# EAGLE design fireboy_esp (EAGLE 7.5.0)
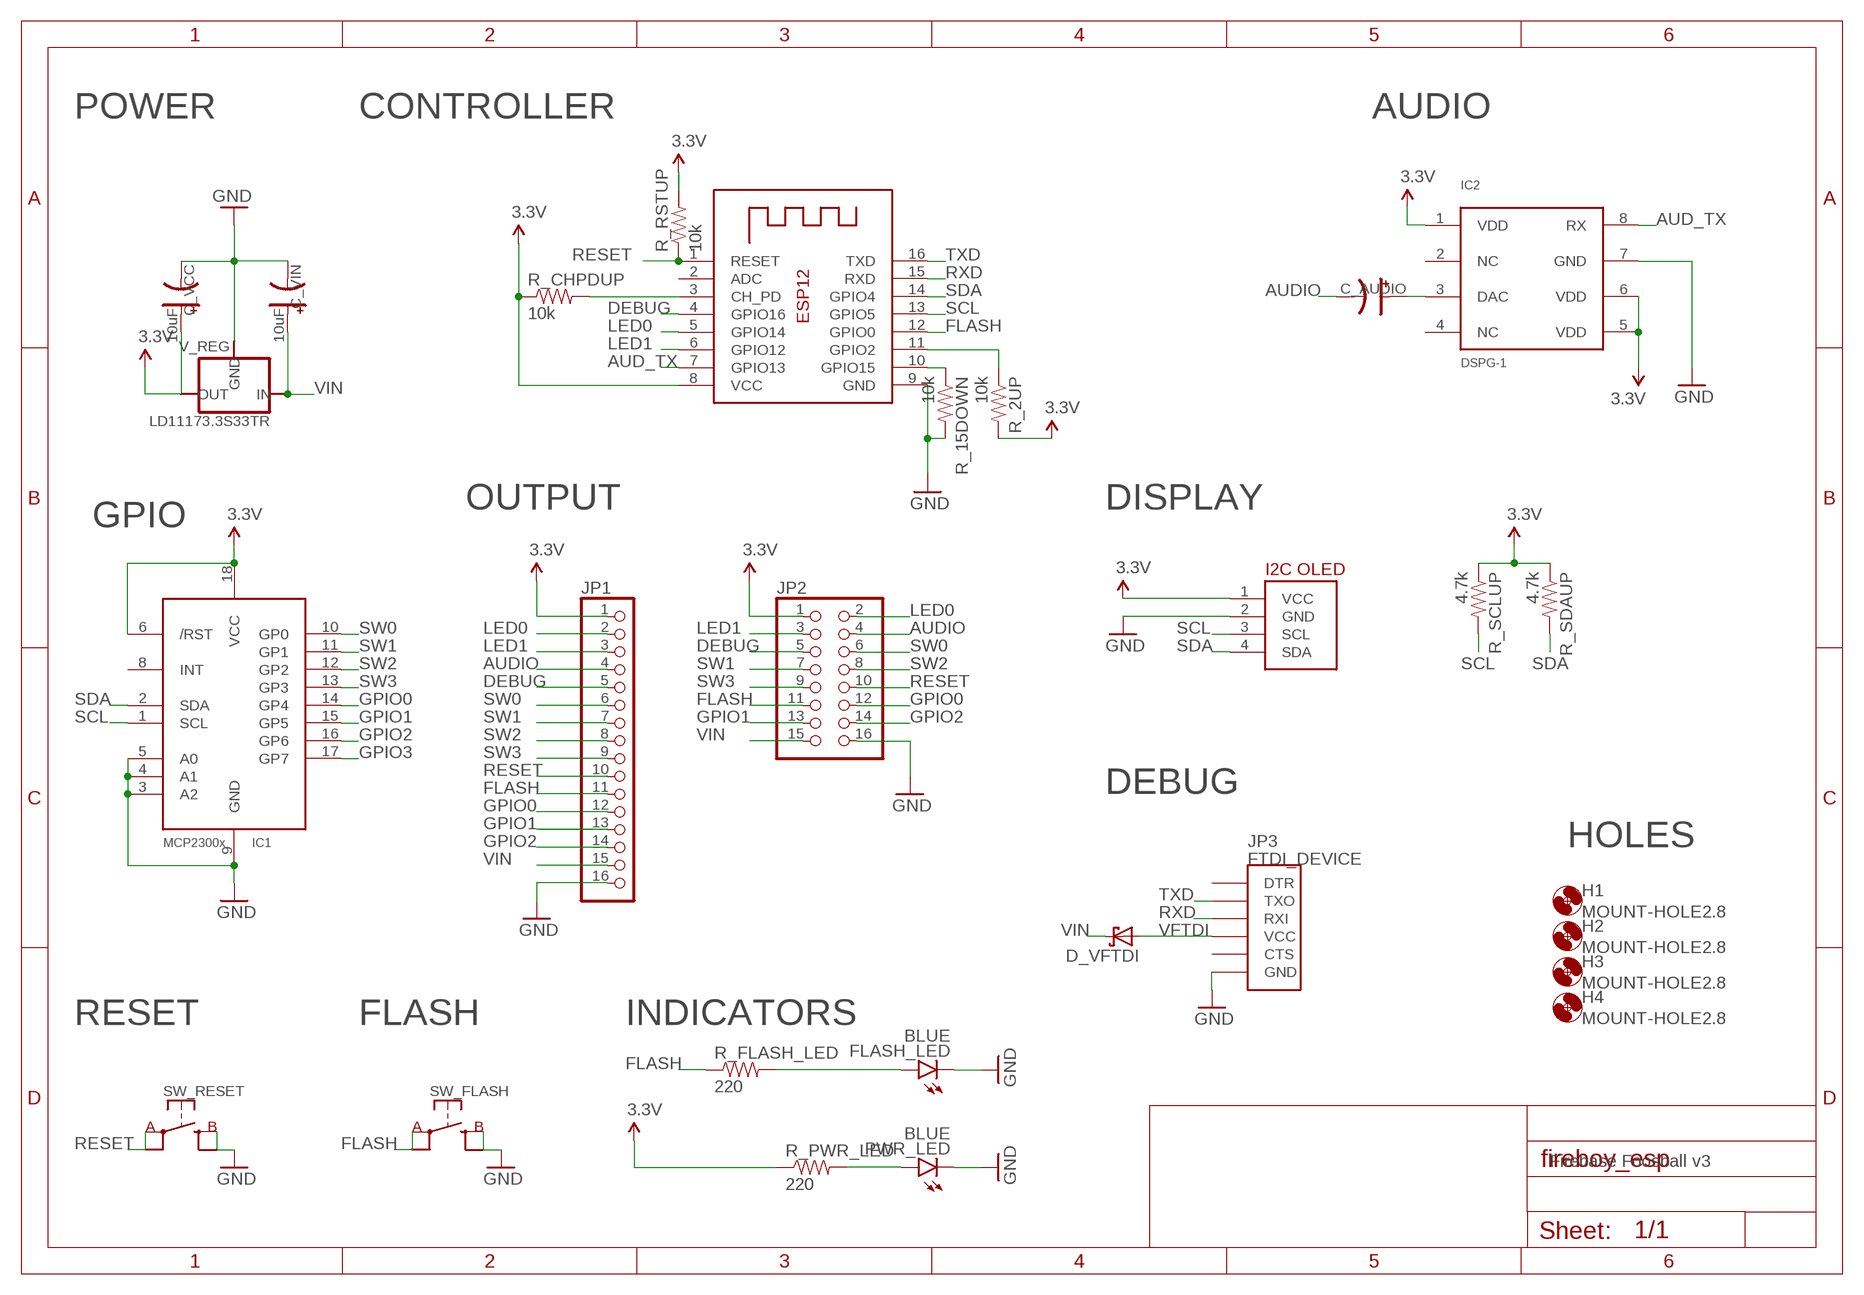
[diagram p0: schematic, sheet 1]

## Parts
C_AUDIO  CAP-POL025X50  [CAP-POL-025X50]
C_VCC  10uF  CAP-POL025X50  [CAP-POL-025X50]
C_VIN  10uF  CAP-POL025X50  [CAP-POL-025X50]
D_VFTDI  SCHOTTKY-DIODEDO41  [DO41-10]
FLASH_LED  BLUE  LED3MM  [LED3MM]
H1  MOUNT-HOLE2.8  [2,8]
H2  MOUNT-HOLE2.8  [2,8]
H3  MOUNT-HOLE2.8  [2,8]
H4  MOUNT-HOLE2.8  [2,8]
IC0  ESP-12  [ESP-12]
IC1  MCP23008/P  [DIL18]
IC2  DSPG-1  [DIL08]
JP1  PINHD-1X16  [1X16]
JP2  PINHD-2X8  [2X08]
JP3  FTDI_DEVICE  [FTDI_DEVICE_SIDE]
PWR_LED  BLUE  LED3MM  [LED3MM]
R_2UP  10k  RESISTORAXIAL-0.3  [AXIAL-0.3]
R_15DOWN  10k  RESISTORAXIAL-0.3  [AXIAL-0.3]
R_CHPDUP  10k  RESISTORAXIAL-0.3  [AXIAL-0.3]
R_FLASH_LED  220  RESISTORAXIAL-0.3  [AXIAL-0.3]
R_PWR_LED  220  RESISTORAXIAL-0.3  [AXIAL-0.3]
R_RSTUP  10k  RESISTORAXIAL-0.3  [AXIAL-0.3]
R_SCLUP  4.7k  RESISTORAXIAL-0.3  [AXIAL-0.3]
R_SDAUP  4.7k  RESISTORAXIAL-0.3  [AXIAL-0.3]
SW_FLASH  SW-SPSTTH06X06  [SW-SPST-TH06X06]
SW_RESET  SW-SPSTTH06X06  [SW-SPST-TH06X06]
U$2  I2C_OLED  [I2C_OLED_PACKAGE]
V_REG  LD11173.3S33TR  [SOT223]

## Nets
3.3V: IC1.6(/RST) IC1.18(VCC) IC2.1(VDD) IC2.5(VDD) IC2.6(VDD) JP1.1 JP2.1 R_2UP.P$2 R_PWR_LED.P$1 R_RSTUP.P$2 R_SCLUP.P$1 R_SDAUP.P$1 U$2.1(VCC)
AUD_TX: IC0.7(GPIO13) IC2.8(RX)
AUDIO: C_AUDIO.C JP1.4 JP2.4
DEBUG: IC0.4(GPIO16) JP1.5 JP2.5
FLASH: IC0.12(GPIO0) JP1.11 JP2.11 R_FLASH_LED.P$1 SW_FLASH.A@1(A)
GND: C_VCC.C C_VIN.C FLASH_LED.K(C) IC0.9(GND) IC1.3(A2) IC1.4(A1) IC1.5(A0) IC1.9(GND) IC2.7(GND) JP1.16 JP2.16 JP3.P$6(GND) PWR_LED.K(C) R_15DOWN.P$2 SW_FLASH.B@1(B) SW_RESET.B@1(B) U$2.2(GND) V_REG.1(GND)
GPIO0: IC1.14(GP4) JP1.12 JP2.12
GPIO1: IC1.15(GP5) JP1.13 JP2.13
GPIO2: IC1.16(GP6) JP1.14 JP2.14
GPIO3: IC1.17(GP7)
LED0: IC0.5(GPIO14) JP1.2 JP2.2
LED1: IC0.6(GPIO12) JP1.3 JP2.3
N$1: IC0.11(GPIO2) R_2UP.P$1
N$2: IC0.10(GPIO15) R_15DOWN.P$1
N$3: IC0.3(CH_PD) R_CHPDUP.P$2
N$4: FLASH_LED.A R_FLASH_LED.P$2
N$5: PWR_LED.A R_PWR_LED.P$2
N$7: C_VCC.A V_REG.2(OUT) V_REG.4(OUT)
N$9: C_AUDIO.A IC2.3(DAC)
R_CHPDUP: IC0.8(VCC) R_CHPDUP.P$1 ; supply symbol labelled 3.3V
RESET: IC0.1(RESET) JP1.10 JP2.10 R_RSTUP.P$1 SW_RESET.A@1(A)
RXD: IC0.15(RXD) JP3.P$3(RXI)
SCL: IC0.13(GPIO5) IC1.1(SCL) R_SCLUP.P$2 U$2.3(SCL)
SDA: IC0.14(GPIO4) IC1.2(SDA) R_SDAUP.P$2 U$2.4(SDA)
SW0: IC1.10(GP0) JP1.6 JP2.6
SW1: IC1.11(GP1) JP1.7 JP2.7
SW2: IC1.12(GP2) JP1.8 JP2.8
SW3: IC1.13(GP3) JP1.9 JP2.9
TXD: IC0.16(TXD) JP3.P$2(TXO)
VFTDI: D_VFTDI.A JP3.P$4(VCC)
VIN: C_VIN.A D_VFTDI.C JP1.15 JP2.15 V_REG.3(IN)
Unconnected: IC0.2(ADC) IC1.8(INT) IC2.2(NC) IC2.4(NC) JP3.P$1(DTR) JP3.P$5(CTS)

## Notes on the sheet
- POWER | CONTROLLER | AUDIO
- OUTPUT | DISPLAY
- GPIO
- DEBUG
- HOLES
- RESET | FLASH | INDICATORS
- Firebase Foosball v3

## Library data of the parts
C_AUDIO C_VCC C_VIN = Ai_Passives:CAP-POL
D_VFTDI = adafruit:SCHOTTKY-DIODE: Schottky Diode
FLASH_LED PWR_LED = SparkFun-LED:LED: LEDs Standard schematic elements and footprints for 5mm, 3mm, 1206, and 0603 sized LEDs. 5mm - Spark Fun Electronics SKU : COM-00529 (and others); PROD_ID: DIO-08794
H1-H4 = holes:MOUNT-HOLE: MOUNTING HOLE with drill center marker
IC0 = adafruit:ESP-12
IC1 = adafruit:MCP23008: MCP23008 Inexpensive i2c i/o expander - 8 general purpose i/o pins with optional pullups
IC2 = afshar:DSPG-1
JP1 = pinhead:PINHD-1X16: PIN HEADER
JP2 = pinhead:PINHD-2X8: PIN HEADER
JP3 = SparkFun-Connectors:FTDI_DEVICE: Connector which mates to FTDI basic or FTDI cable.
R_2UP R_15DOWN R_CHPDUP R_FLASH_LED R_PWR_LED R_RSTUP R_SCLUP R_SDAUP = SparkFun-Resistors:RESISTOR: Resistor Basic schematic elements and footprints for 0603, 1206, and PTH resistors.
SW_FLASH SW_RESET = Ai_Electromechanical:SW-SPST
U$2 = DIYMall_OLED:I2C_OLED
V_REG = Ai_Power:LD1117*: Voltage Regulator LD1117 Standard adjustable voltage regulator.

## Board
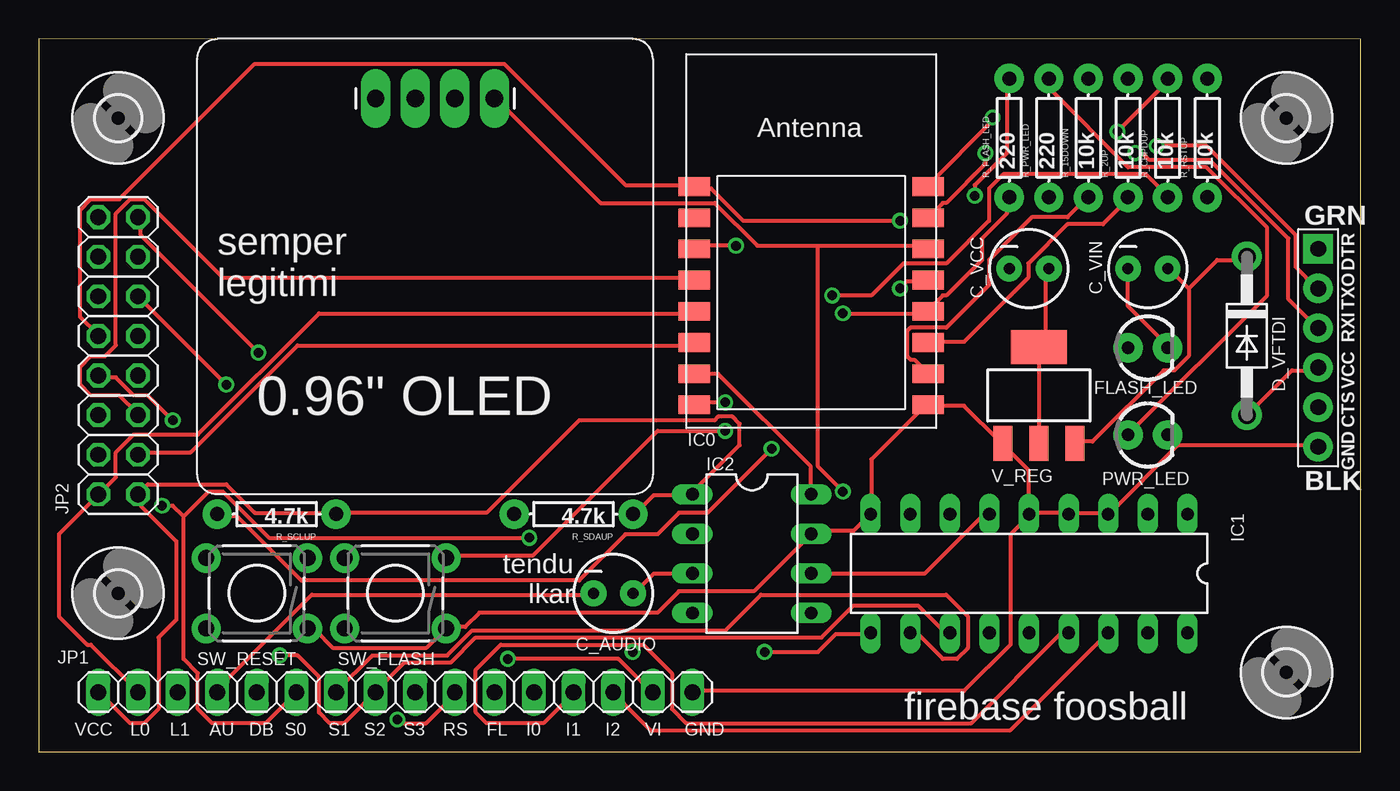
[diagram p1: board, top side]
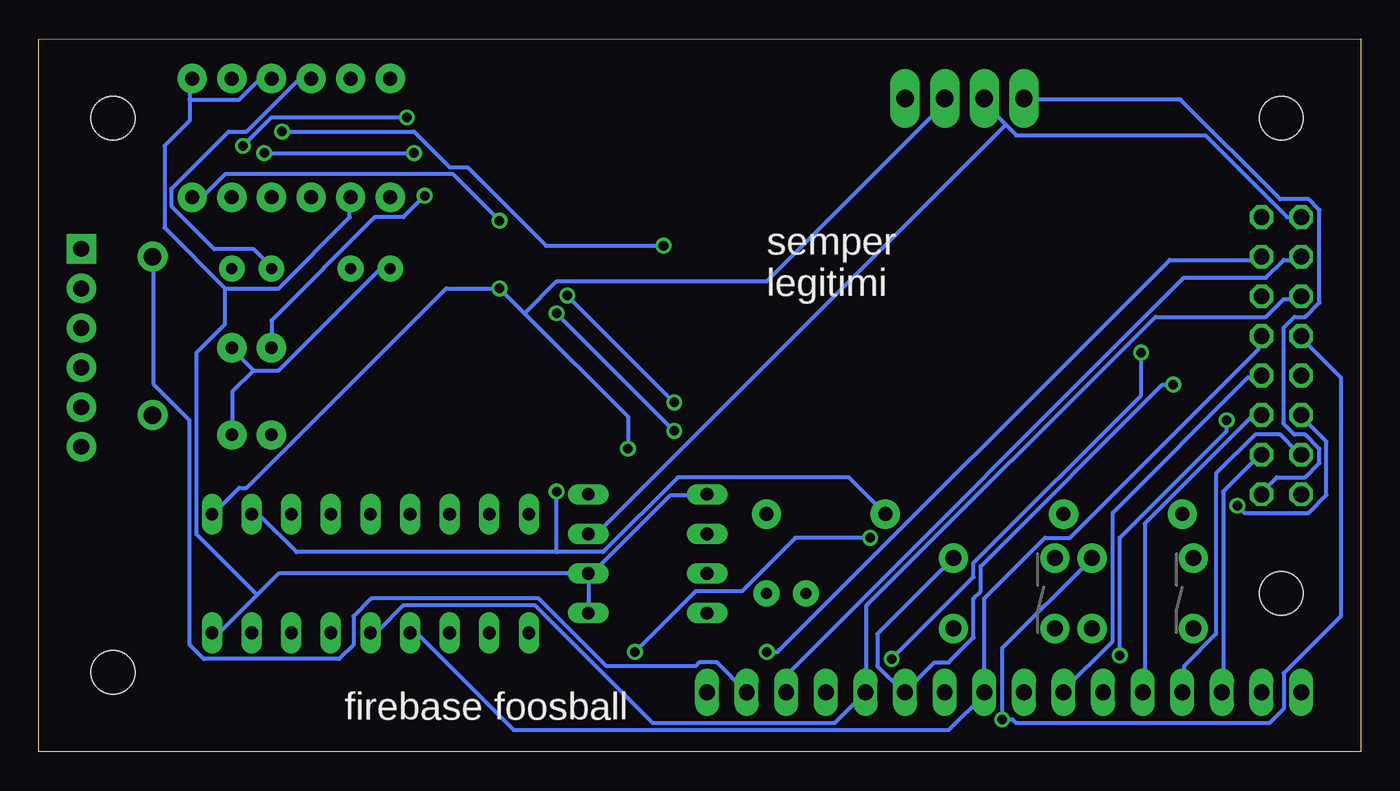
[diagram p2: board, bottom side, seen from below]

Size 84.76 x 45.72 mm. Coordinates in mm from the lower left corner, seen from the top.
Outline: 0,0 84.76,0 84.76,45.71 0,45.72 0,0
Copper layers (1*16): Top 0.035mm / dielectric 1.5mm / Bottom 0.035mm
Design rules "default": minimum track width 10mil, minimum drill 24mil, track to track 8mil, track to pad 8mil, pad to pad 8mil, via to via 8mil, smd to smd 8mil, copper to edge 40mil, drill to drill 8mil, minimum pad ring 10mil, minimum via ring 8mil, stop-mask expansion 4mil, vias tented up to drill 0mil, thermal gap 10mil

### Footprints (pad centres in the part's own frame; a part is rotated, then mirrored left to right if it is on the bottom)
CAP-POL-025X50 = drill 0.7 pad 1.651: A 1.27,0; C -1.27,0
DO41-10 = drill 1.118 pad 1.93: A 5.08,0; C -5.08,0
LED3MM = drill 0.813 pad 1.88: A -1.27,0; K 1.27,0
2,8 = hole 2.8: 0,0
ESP-12 = smd 2 x 1.2: 1 -7.5,4.5; 2 -7.5,2.5; 3 -7.5,0.5; 4 -7.5,-1.5; 5 -7.5,-3.5; 6 -7.5,-5.5; 7 -7.5,-7.5; 8 -7.5,-9.5; 9 7.5,-9.5; 10 7.5,-7.5; 11 7.5,-5.5; 12 7.5,-3.5; 13 7.5,-1.5; 14 7.5,0.5; 15 7.5,2.5; 16 7.5,4.5
DIL18 = drill 0.813 long: 1 -10.16,-3.81; 2 -7.62,-3.81; 3 -5.08,-3.81; 4 -2.54,-3.81; 5 0,-3.81; 6 2.54,-3.81; 7 5.08,-3.81; 8 7.62,-3.81; 9 10.16,-3.81; 10 10.16,3.81; 11 7.62,3.81; 12 5.08,3.81; 13 2.54,3.81; 14 0,3.81; 15 -2.54,3.81; 16 -5.08,3.81; 17 -7.62,3.81; 18 -10.16,3.81
DIL08 = drill 0.813 long: 1 -3.81,-3.81; 2 -1.27,-3.81; 3 1.27,-3.81; 4 3.81,-3.81; 5 3.81,3.81; 6 1.27,3.81; 7 -1.27,3.81; 8 -3.81,3.81
1X16 = drill 1.016 long: 1 -19.05,0; 2 -16.51,0; 3 -13.97,0; 4 -11.43,0; 5 -8.89,0; 6 -6.35,0; 7 -3.81,0; 8 -1.27,0; 9 1.27,0; 10 3.81,0; 11 6.35,0; 12 8.89,0; 13 11.43,0; 14 13.97,0; 15 16.51,0; 16 19.05,0
2X08 = drill 1.016 octagon: 1 -8.89,-1.27; 2 -8.89,1.27; 3 -6.35,-1.27; 4 -6.35,1.27; 5 -3.81,-1.27; 6 -3.81,1.27; 7 -1.27,-1.27; 8 -1.27,1.27; 9 1.27,-1.27; 10 1.27,1.27; 11 3.81,-1.27; 12 3.81,1.27; 13 6.35,-1.27; 14 6.35,1.27; 15 8.89,-1.27; 16 8.89,1.27
FTDI_DEVICE_SIDE = drill 1.016 pad 1.88 square: P$1 -6.35,0 | drill 1.016 pad 1.88: P$2 -3.81,0; P$3 -1.27,0; P$4 1.27,0; P$5 3.81,0; P$6 6.35,0
AXIAL-0.3 = drill 0.9 pad 1.88: P$1 -3.81,0; P$2 3.81,0
SW-SPST-TH06X06 = drill 1.016 pad 1.88: A@1 -3.251,-2.261; A@2 3.251,-2.261; B@1 -3.251,2.261; B@2 3.251,2.261
I2C_OLED_PACKAGE = drill 1.118 pad 1.88 long: 1 0,0; 2 2.54,0; 3 5.08,0; 4 7.62,0
SOT223 = smd 1.219 x 2.235: 1 -2.311,-3.099; 2 0,-3.099; 3 2.311,-3.099 | smd 3.6 x 2.2: 4 0,3.099

### Placement (x,y rotation side)
C_AUDIO  36.83,10.16 0 top
C_VCC  63.5,30.99 0 top
C_VIN  71.12,30.99 0 top
D_VFTDI  77.47,26.67 270 top
FLASH_LED  71.12,25.91 0 top
H1  80.01,5.08 0 top
H2  5.08,10.16 0 top
H3  80.01,40.64 0 top
H4  5.08,40.64 0 top
IC0  49.53,31.75 0 top
IC1  63.5,11.43 180 top
IC2  45.72,12.7 270 top
JP1  22.86,3.81 0 top
JP2  5.08,25.4 90 top
JP3  82.04,25.91 270 top
PWR_LED  71.12,20.32 0 top
R_2UP  69.85,39.37 90 top
R_15DOWN  67.31,39.37 90 top
R_CHPDUP  72.39,39.37 90 top
R_FLASH_LED  62.23,39.37 90 top
R_PWR_LED  64.77,39.37 90 top
R_RSTUP  74.93,39.37 90 top
R_SCLUP  15.24,15.24 180 top
R_SDAUP  34.29,15.24 180 top
SW_FLASH  22.86,10.16 180 top
SW_RESET  13.97,10.16 180 top
U$2  21.59,41.91 0 top
V_REG  64.14,22.86 0 top

### Tracks (layer width: path | path; a pad name or v marks a point on that pad's centre or on a via)
3.3V
  Top 0.254: JP1.1 4.01,3.66 5.84,1.83 6.76,1.83 7.67,2.74 7.67,7.31 8.81,8.46 8.81,13.49 6.53,15.77 6.53,16.46 JP2.1 6.98,17.15 12.01,17.15 13.84,15.32 18.87,15.32 R_SCLUP.P$1 19.1,15.32 28.7,15.32 34.65,21.26 43.33,21.26 43.56,21.49 44.47,21.49 44.93,21.03 44.93,19.66 41.96,16.69 IC2.1 41.73,16.46 39.45,16.46 38.3,15.32 R_SDAUP.P$1 | IC2.6 56.82,11.43 60.48,15.09 60.94,15.09 IC1.6
  Bottom 0.254: U$2.1 21.39,41.83 11.56,41.83 5.16,35.43 3.33,35.43 2.64,34.75 2.64,28.8 3.56,27.89 4.24,27.89 4.93,27.2 4.93,21.03 4.24,20.34 3.56,20.34 2.64,19.43 2.64,18.52 3.56,17.6 5.38,17.6 6.3,16.69 JP2.1 | 72.82,29.72 69.39,29.72 64.82,34.29 64.82,35.43 R_PWR_LED.P$1 | 72.82,29.72 76.71,33.6 76.71,38.86 75.11,40.46 75.11,41.83 | 75.11,41.83 75.11,42.98 R_RSTUP.P$2 | 75.11,41.83 71.91,41.83 70.76,42.98 69.85,42.98 R_2UP.P$2 | 70.76,10.06 69.39,11.43 IC2.6 | 70.76,10.06 73.05,7.77 73.51,7.77 IC1.18 | 49.5,11.2 49.5,11.43 IC2.6 | 49.5,11.2 49.5,8.91 IC2.5 | 49.5,11.2 44.25,16.46 41.96,16.46 IC2.1 | 49.5,11.2 IC2.6 | 72.82,29.72 72.82,27.43 74.65,25.6 74.65,13.95 70.76,10.06
AUD_TX
  Top 0.254: IC0.7 42.19,24.23 43.56,24.23 49.5,18.29 49.5,16.69 IC2.8
AUDIO
  Top 0.254: C_AUDIO.C 35.56,10.06 17.5,10.06 11.33,3.89 JP1.4
  Bottom 0.254: JP1.4 11.33,3.89 11.33,5.49 9.27,7.54 9.27,17.83 6.76,20.34 5.16,20.34 4.01,19.2 JP2.4
DEBUG
  Top 0.254: IC0.4 41.96,30.4 11.79,30.4 6.76,35.43 5.84,35.43 4.93,34.52 4.93,26.06 4.24,25.38 3.33,25.38 2.64,24.69 2.64,23.55 3.33,22.86 5.16,22.86 6.3,21.72 JP2.5
  Bottom 0.254: JP1.5 13.84,3.89 13.84,14.63 6.98,21.49 6.53,21.49 JP2.5
FLASH  (via drill 0.61)
  Top 0.254: R_FLASH_LED.P$1 62.08,35.43 62.08,34.52 60.48,32.92 60.48,31.55 58.19,29.26 57.96,29.26 57.05,28.35 IC0.12 56.82,28.12 v51.56,28.12 | v12.01,23.55 JP2.11 | v44.02,20.57 39.67,20.57 31.67,12.57 26.19,12.57 SW_FLASH.A@1
  Bottom 0.254: SW_FLASH.A@1 30.99,7.54 30.99,5.49 29.39,3.89 JP1.11 29.16,3.89 27.33,5.72 26.42,5.72 24.82,7.31 24.82,9.83 24.36,10.29 24.36,11.89 12.7,23.55 v12.01,23.55 | v44.02,20.57 v51.56,28.12
GND
  Top 0.254: C_VIN.C 69.85,28.58 72.37,26.06 FLASH_LED.K | 73.05,19.66 81.97,19.66 JP3.P$6 | 73.05,19.66 PWR_LED.K 72.59,20.12 | IC1.5 63.68,15.32 65.96,15.32 IC1.4 66.19,15.32 68.48,15.32 IC1.3 68.71,15.32 73.05,19.66 | JP1.16 41.96,3.89 59.33,3.89 62.31,6.86 62.31,13.95 63.45,15.09 IC1.5 | SW_RESET.B@1 17.27,7.77 17.73,7.77 18.87,6.63 24.82,6.63 25.96,7.77 SW_FLASH.B@1 26.19,8 27.33,8 28.25,8.91 39.67,8.91 41.05,10.29 45.85,10.29 IC2.7 49.73,14.17 52.25,14.17 53.16,15.09 IC1.9 53.39,15.32 53.39,18.74 56.82,22.17 IC0.9 57.05,22.17 59.33,22.17 61.62,19.89 V_REG.1 61.85,19.66 63.45,18.06 63.45,15.32 IC1.5
  Bottom 0.254: 70.99,24.46 69.39,24.46 62.99,30.86 62.31,30.86 C_VCC.C | 70.99,24.46 72.37,25.83 FLASH_LED.K | R_15DOWN.P$2 67.34,42.98 68.25,42.98 71.45,39.78 72.59,39.78 76.25,36.12 76.25,34.98 73.51,32.23 70.99,32.23 69.85,31.09 C_VIN.C | 70.99,24.46 72.37,23.09 72.37,20.34 PWR_LED.K | JP2.16 4.7,34.29 9.96,39.55 22.07,39.55 22.76,40.23 | 22.76,40.23 24.13,41.6 U$2.2 | 22.76,40.23 48.82,14.17 49.5,14.17 IC2.7
GPIO0
  Bottom 0.254: IC1.14 63.45,7.77 62.99,7.77 61.39,9.37 52.93,9.37 45.39,1.83 33.73,1.83 JP1.12 31.67,3.89 31.67,9.37 13.16,27.89 6.07,27.89 4.93,29.03 4.01,29.03 JP2.12
GPIO1  (via drill 0.61)
  Top 0.254: 38.08,6.86 29.62,6.86 28.02,5.26 28.02,2.52 28.7,1.83 32.36,1.83 34.19,3.66 JP1.13 | 38.08,6.86 38.76,6.86 40.59,5.03 40.59,2.74 41.5,1.83 59.79,1.83 65.51,7.54 65.96,7.54 IC1.15 | 38.08,6.86 v38.08,6.4
  Bottom 0.254: v38.08,6.4 37.39,6.4 12.24,31.55 6.53,31.55 JP2.13
GPIO2
  Top 0.254: IC1.16 68.48,7.54 62.31,1.37 39.22,1.37 36.93,3.66 JP1.14
  Bottom 0.254: JP2.14 4.01,31.55 4.93,31.55 6.07,30.4 11.33,30.4 36.7,5.03 36.7,3.89 JP1.14
LED0
  Top 0.254: IC0.5 41.96,28.12 17.96,28.12 10.18,20.34 6.07,20.34 4.93,19.2 4.93,17.6 4.01,16.69 JP2.2 3.79,16.46 1.27,13.95 1.27,8.69 3.1,6.86 3.33,6.86 6.3,3.89 JP1.2
LED1
  Top 0.254: IC0.6 41.96,26.06 16.59,26.06 9.73,19.2 6.53,19.2 JP2.3
  Bottom 0.254: JP1.3 8.81,3.89 8.81,16.69 6.53,18.97 JP2.3
N$1
  Top 0.254: IC0.11 57.05,26.29 59.33,26.29 63.45,30.4 63.45,31.32 65.96,33.83 68.25,33.83 69.85,35.43 R_2UP.P$1
N$2
  Top 0.254: IC0.10 56.13,25.15 55.91,25.15 55.68,25.38 55.68,26.98 55.91,27.2 58.19,27.2 60.94,29.95 60.94,31.55 63.68,34.29 65.96,34.29 67.11,35.43 R_15DOWN.P$1
N$3  (via drill 0.61)
  Top 0.254: v44.7,32.46 42.19,32.46 IC0.3 | v69.16,39.78 72.37,42.98 R_CHPDUP.P$2
  Bottom 0.254: v44.7,32.46 52.25,32.46 57.28,37.49 58.42,37.49 60.71,39.78 v69.16,39.78
N$4  (via drill 0.61)
  Top 0.254: v60.02,35.66 60.02,36.35 62.08,38.4 62.08,42.98 R_FLASH_LED.P$2
  Bottom 0.254: FLASH_LED.A 69.85,27.66 63.22,34.29 61.39,34.29 v60.02,35.66
N$5
  Top 0.254: R_PWR_LED.P$2 64.82,42.98 64.82,42.52 69.85,37.49 74.88,37.49 78.77,33.6 78.77,29.26 69.85,20.34 PWR_LED.A
N$7
  Top 0.254: V_REG.2 V_REG.4 64.14,26.06 64.59,26.52 64.59,30.86 C_VCC.A
N$9
  Top 0.254: IC2.3 39.45,11.43 38.3,10.29 C_AUDIO.A
R_CHPDUP  (via drill 0.61)
  Top 0.254: v44.02,22.4 42.19,22.4 IC0.8 | v50.88,29.26 53.39,29.26 55.45,31.32 58.19,31.32 60.94,34.06 60.94,36.12 61.85,37.03 70.99,37.03 72.37,35.66 R_CHPDUP.P$1
  Bottom 0.254: v50.88,29.26 v44.02,22.4
RESET  (via drill 0.61)
  Top 0.254: v22.99,2.06 23.22,1.83 24.82,1.83 26.64,3.66 JP1.10 | JP2.10 3.79,26.75 2.64,27.89 2.64,34.75 3.33,35.43 5.16,35.43 13.84,44.12 29.85,44.12 37.62,36.35 41.96,36.35 IC0.1 42.19,36.12 43.1,36.12 45.16,34.06 v55.22,34.06
  Bottom 0.254: SW_RESET.A@1 17.27,12.34 22.99,6.63 v22.99,2.06 22.3,2.06 22.07,1.83 5.84,1.83 4.93,2.74 4.93,5.03 1.27,8.69 1.27,24 3.79,26.52 JP2.10 | v55.22,34.06 58.19,37.03 72.82,37.03 74.19,35.66 74.88,35.66 R_RSTUP.P$1
RXD  (via drill 0.61)
  Top 0.254: v60.71,38.4 60.71,37.72 58.19,35.2 57.96,35.2 57.05,34.29 IC0.15 | v70.31,38.4 70.76,38.4 71.22,37.95 75.11,37.95 80.14,32.92 80.14,29.03 81.97,27.2 JP3.P$3
  Bottom 0.254: v70.31,38.4 v60.71,38.4
SCL  (via drill 0.61)
  Top 0.254: v55.22,29.72 55.68,30.18 56.82,30.18 IC0.13 | v46.99,19.43 42.88,15.32 41.05,15.32 39.67,13.95 37.62,13.95 34.65,10.97 16.82,10.97 12.7,15.09 11.56,15.09 R_SCLUP.P$2
  Bottom 0.254: IC1.1 73.51,15.32 71.91,16.92 71.45,16.92 58.65,29.72 v55.22,29.72 53.62,28.12 | v46.99,19.43 46.99,21.49 53.62,28.12 | 53.62,28.12 51.56,30.18 38.08,30.18 26.87,41.38 26.87,41.83 U$2.3
SDA  (via drill 0.61)
  Top 0.254: 49.96,32.46 46.08,32.46 43.33,35.2 36.02,35.2 29.39,41.83 U$2.4 | 49.96,32.46 56.82,32.46 IC0.14 | 49.96,32.46 49.96,18.29 v51.56,16.69
  Bottom 0.254: 51.56,12.8 48.59,12.8 43.79,17.6 32.82,17.6 30.53,15.32 R_SDAUP.P$2 | 51.56,12.8 68.25,12.8 70.54,15.09 70.99,15.09 IC1.2 | 51.56,12.8 v51.56,16.69
SW0  (via drill 0.61)
  Top 0.254: v46.53,6.4 49.96,6.4 51.11,7.54 53.16,7.54 IC1.10 | v31.44,13.72 14.76,13.72 11.79,16.69 10.87,16.69 9.27,15.09 | 9.27,15.09 9.27,5.94 10.18,5.03 10.18,2.74 11.1,1.83 14.53,1.83 JP1.6 | v7.9,15.77 8.59,15.77 9.27,15.09
  Bottom 0.254: v46.53,6.4 42.65,10.29 39.67,10.29 36.25,13.72 v31.44,13.72 | v7.9,15.77 7.44,15.32 3.33,15.32 2.18,16.46 2.18,19.89 3.79,21.49 JP2.6
SW1
  Top 0.254: IC1.11 55.91,7.54 56.36,7.54 57.96,5.94 58.88,5.94 59.56,6.63 59.56,8.69 58.19,10.06 46.3,10.06 44.02,7.77 27.79,7.77 26.19,6.17 21.39,6.17 19.1,3.89 JP1.7
  Bottom 0.254: JP2.7 6.53,24 7.21,24 15.9,15.32 15.9,7.09 19.1,3.89 JP1.7
SW2  (via drill 0.61)
  Top 0.254: IC1.12 58.42,7.77 57.96,7.77 56.36,9.37 52.25,9.37 50.19,7.31 28.02,7.31 26.42,5.72 23.44,5.72 21.61,3.89 JP1.8 21.39,3.66 19.56,1.83 18.64,1.83 17.96,2.52 17.96,4.8 16.59,6.17 v15.44,6.17 | v8.59,21.26 6.98,22.86 6.07,22.86 4.93,24 4.01,24 JP2.8
  Bottom 0.254: v8.59,21.26 8.59,20.57 15.44,13.72 v15.44,6.17
SW3
  Bottom 0.254: IC1.13 60.94,7.54 60.48,7.54 54.31,1.37 26.42,1.37 24.13,3.66 JP1.9 24.13,9.83 20.24,13.72 18.64,13.72 6.53,25.83 6.53,26.52 JP2.9
TXD  (via drill 0.61)
  Top 0.254: v61.16,40.69 61.16,40.46 57.05,36.35 IC0.16 | v71.68,38.86 74.88,38.86 80.59,33.15 80.59,31.09 81.97,29.72 JP3.P$2
  Bottom 0.254: v61.16,40.69 69.85,40.69 v71.68,38.86
VFTDI
  Top 0.254: JP3.P$4 81.97,24.46 80.37,24.46 77.62,21.72 D_VFTDI.A
VIN  (via drill 0.61)
  Top 0.254: 73.74,29.72 73.74,25.38 72.82,24.46 72.14,24.46 67.56,19.89 66.65,19.89 V_REG.3 | 73.74,29.72 72.59,30.86 C_VIN.A | 73.74,29.72 75.56,31.55 77.39,31.55 D_VFTDI.C | v14.07,25.6 6.53,33.15 6.53,34.29 JP2.15 | v30.07,5.94 37.16,5.94 39.22,3.89 JP1.15
  Bottom 0.254: v14.07,25.6 14.07,22.86 24.82,12.12 24.82,11.2 v30.07,5.94 | JP1.15 41.28,5.72 42.42,5.72 42.65,5.49 48.36,5.49 52.7,9.83 63.45,9.83 64.59,8.69 64.59,6.86 65.51,5.94 74.19,5.94 75.11,6.86 75.11,21.26 77.39,23.55 77.39,31.55 D_VFTDI.C

### Text on the board
tPlace: semper / legitimi | firebase foosball | VCC | L0 | L1 | AU | DB | S0 | S1 | S2 | S3 | RS | FL | I0 | I1 | I2 | VI | GND
bPlace: semper / legitimi | firebase foosball
tNames: tendu / lkar